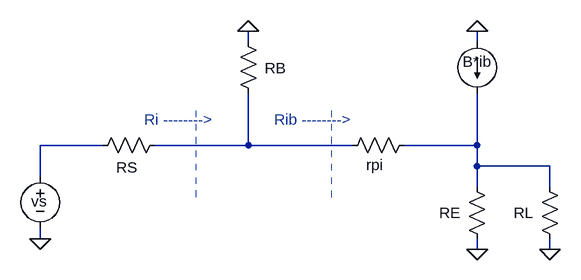
[diagram p0: schematic prob6_50D_AC_small-signal_with_1k-load.asc]
prob6_50D_AC_small-signal_with_1k-load.asc, the LTspice schematic file:
Version 4
SHEET 1 880 680
WIRE 288 -64 288 -80
WIRE 640 -64 640 -80
WIRE 64 96 -32 96
WIRE 288 96 288 16
WIRE 288 96 144 96
WIRE 448 96 288 96
WIRE 640 96 640 16
WIRE 640 96 528 96
WIRE 640 128 640 96
WIRE 752 128 640 128
WIRE -32 144 -32 96
WIRE 640 160 640 128
WIRE 752 160 752 128
WIRE -32 240 -32 224
WIRE 640 256 640 240
WIRE 752 256 752 240
FLAG -32 240 0
FLAG 640 256 0
FLAG 288 -80 0
FLAG 640 -80 0
FLAG 752 256 0
SYMBOL voltage -32 128 R0
WINDOW 0 -14 54 Left 2
SYMATTR InstName vs
SYMATTR Value ""
SYMBOL res 272 -80 R0
WINDOW 0 41 57 Left 2
SYMATTR InstName RB
SYMATTR Value ""
SYMBOL res 160 80 R90
WINDOW 0 66 59 VBottom 2
WINDOW 3 32 56 VTop 2
SYMATTR InstName RS
SYMATTR Value ""
SYMBOL res 544 80 R90
WINDOW 0 62 61 VBottom 2
WINDOW 3 32 56 VTop 2
SYMATTR InstName rpi
SYMATTR Value ""
SYMBOL res 656 256 R180
WINDOW 0 41 56 Left 2
WINDOW 3 36 40 Left 2
SYMATTR InstName RE
SYMATTR Value ""
SYMBOL current 640 -64 R0
WINDOW 0 -22 31 Left 2
SYMATTR InstName B*ib
SYMATTR Value ""
SYMBOL res 768 256 R180
WINDOW 0 41 56 Left 2
WINDOW 3 36 40 Left 2
SYMATTR InstName RL
SYMATTR Value ""
TEXT 328 56 Left 2 ;Rib -------->
TEXT 128 56 Left 2 ;Ri -------->
LINE Normal 416 176 416 32 2
LINE Normal 208 176 208 32 2

The netlist it stands for:
* prob6_50D_AC_small-signal_with_1k-load.asc
vs N001 0
RB 0 N002
RS N002 N001
rpi N003 N002
RE 0 N003
I§B*ib 0 N003
RL 0 N003
* Rib -------->
* Ri -------->
.backanno
.end